# Altium schematic sheet DCDC_TPS62410_1V1_1V2.SchDoc
size A4
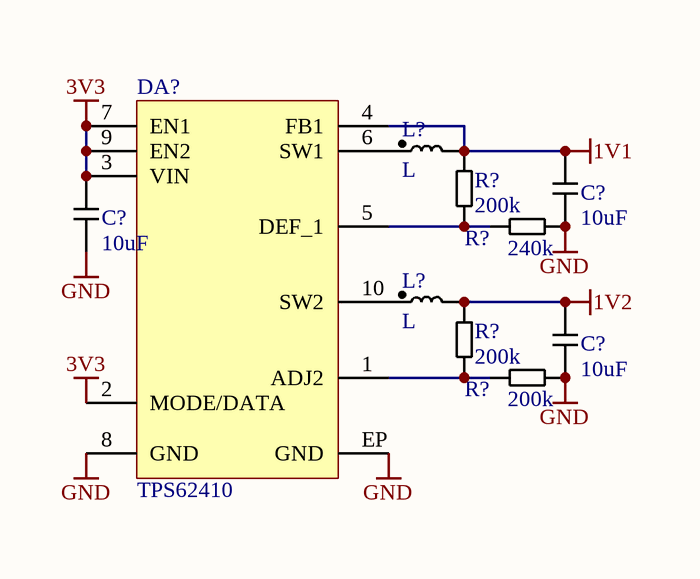
[diagram p0: DCDC_TPS62410_1V1_1V2.SchDoc]

## Parts
(Parts that share a designator on the sheet are numbered #1, #2 ... from top to bottom, then left to right.)
C?#1  10uF  [C0603]
C?#2  10uF  [C0603]
C?#3  10uF  [C0603]
DA?  TPS62410  [VSON-10]
L?#1  L  [L0603]
L?#2  L  [L0603]
R?#1  200k  [R0603]
R?#2  240k  [R0603]
R?#3  200k  [R0603]
R?#4  200k  [R0603]

## Nets
1V1: C?#1.1 DA?.4(FB1) L?#1.2 R?#1.2
1V2: C?#3.1 L?#2.2 R?#3.2
3V3: C?#2.1 DA?.2(MODE/DATA) DA?.3(VIN) DA?.7(EN1) DA?.9(EN2)
GND: C?#1.2 C?#2.2 C?#3.2 DA?.8(GND) DA?.EP(GND) R?#2.1 R?#4.1
NetDA?_1: DA?.1(ADJ2) R?#3.1 R?#4.2
NetDA?_5: DA?.5(DEF_1) R?#1.1 R?#2.2
NetDA?_6: DA?.6(SW1) L?#1.1
NetDA?_10: DA?.10(SW2) L?#2.1

## Library data of the parts
C?#1-C?#3 = C: Capacitor
DA? = TPS62410: TI 2 channel DC-DC buck
L?#1 L?#2 = L: Inductor
R?#1-R?#4 = R: Resistor